# Altium schematic sheet Audio.SchDoc
size A4; DocumentNumber: 4; Revision: B.2(PCB.SCH); SheetNumber: 4; SheetTotal: 6
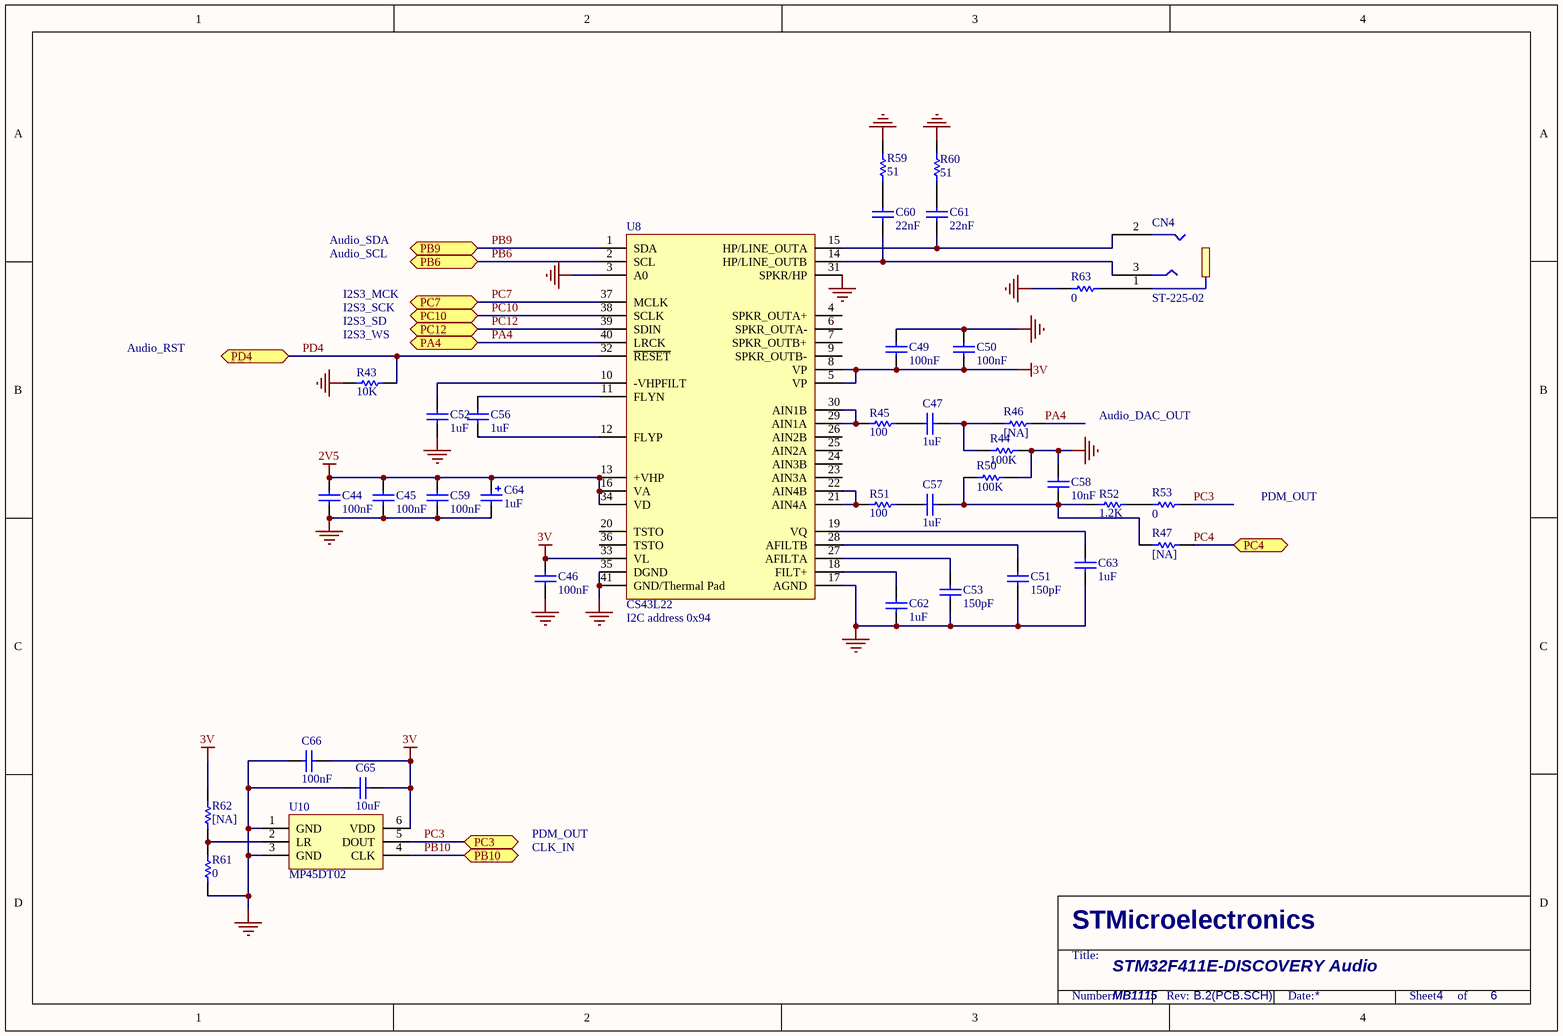
[diagram p0: Audio.SchDoc]

## Parts
C44  100nF  [0402C]
C45  100nF  [0402C]
C46  100nF  [0402C]
C47  1uF  [0603C]
C49  100nF  [0402C]
C50  100nF  [0402C]
C51  150pF  [0603C]
C52  1uF  [0603C]
C53  150pF  [0603C]
C56  1uF  [0603C]
C57  1uF  [0603C]
C58  10nF  [0603C]
C59  100nF  [0402C]
C60  22nF  [0603C]
C61  22nF  [0603C]
C62  1uF  [0603C]
C63  1uF  [0603C]
C64  1uF  [TAN-A]
C65  10uF  [0603C]
C66  100nF  [0402C]
CN4  ST-225-02  [Jack-ST-225]
R43  10K  [0402R]
R44  100K  [0402R]
R45  100  [0402R]
R46  [NA]  [0402R]
R47  [NA]  [0402R]
R50  100K  [0402R]
R51  100  [0402R]
R52  1.2K  [0402R]
R53  0  [0402R]
R59  51  [0402R]
R60  51  [0402R]
R61  0  [0402R]
R62  [NA]  [0402R]
R63  0  [0402R]
U8  CS43L22  [QFN40]
U10  MP45DT02  [HLGA-4.72-3.76-6LD]

## Ports
PA4, PB6, PB9, PB10, PC3, PC4, PC7, PC10, PC12, PD4

## Nets
2V5: C44.2 C45.2 C59.2 C64.1 U8.13(+VHP) U8.16(VA) U8.34(VD)
3V: C46.2 C49.1 C50.2 C65.2 C66.2 R62.2 U8.5(VP) U8.8(VP) U8.33(VL) U10.6(VDD)
GND: C44.1 C45.1 C46.1 C49.2 C50.1 C51.1 C52.2 C53.1 C58.2 C59.1 C62.1 C63.1 C64.2 C65.1 C66.1 R43.2 R44.2 R50.2 R59.2 R60.1 R61.1 R63.1 U8.3(A0) U8.17(AGND) U8.31(SPKR/HP) U8.35(DGND) U8.41(GND/Thermal_Pad) U10.1(GND) U10.3(GND)
PA4: R46.2 U8.40(LRCK) ; port PA4
PB6: U8.2(SCL) ; port PB6
PB9: U8.1(SDA) ; port PB9
PB10: U10.4(CLK) ; port PB10
PC3: R53.2 U10.5(DOUT) ; port PC3
PC4: R47.2 ; port PC4
PC7: U8.37(MCLK) ; port PC7
PC10: U8.38(SCLK) ; port PC10
PC12: U8.39(SDIN) ; port PC12
PD4: R43.1 U8.32(~{RESET}) ; port PD4
NetC47_1: C47.1 R45.1
NetC47_2: C47.2 R44.1 R46.1
NetC51_2: C51.2 U8.28(AFILTB)
NetC52_1: C52.1 U8.10(-VHPFILT)
NetC53_2: C53.2 U8.27(AFILTA)
NetC56_1: C56.1 U8.12(FLYP)
NetC56_2: C56.2 U8.11(FLYN)
NetC57_1: C57.1 R51.1
NetC57_2: C57.2 C58.1 R47.1 R50.1 R52.1
NetC60_1: C60.1 CN4.3 U8.14(HP/LINE_OUTB)
NetC60_2: C60.2 R59.1
NetC61_1: C61.1 CN4.2 U8.15(HP/LINE_OUTA)
NetC61_2: C61.2 R60.2
NetC62_2: C62.2 U8.18(FILT+)
NetC63_2: C63.2 U8.19(VQ)
NetCN4_1: CN4.1 R63.2
NetR45_2: R45.2 U8.29(AIN1A) U8.30(AIN1B)
NetR51_2: R51.2 U8.21(AIN4A) U8.22(AIN4B)
NetR52_2: R52.2 R53.1
NetR61_2: R61.2 R62.1 U10.2(LR)

Not connected (* = marked no-connect by the designer): U8 4(SPKR_OUTA+) 6(SPKR_OUTA-) 7(SPKR_OUTB+) 9(SPKR_OUTB-) 20(TSTO) 23(AIN3A) 24(AIN3B) 25(AIN2A) 26(AIN2B) 36(TSTO)

## Notes on the sheet
- Audio_SDA
- Audio_SCL
- I2S3_MCK
- I2S3_SCK
- Audio_RST
- (near R43) I2S3_WS
- I2S3_SD
- Audio_DAC_OUT
- PDM_OUT
- (near U8) I2C address 0x94
- CLK_IN
- STM32F411E-DISCOVERY Audio
- MB1115
- STMicroelectronics
- Title:
- Number:
- Rev:
- Date:
- Sheet       of

## Library data of the parts
C44-C46 C49 C50 C59 C66 = Cap_100nF_X7R_10%_0402: Capacitor,100nF,16V,X7R,10%,0402,YAGEO; Manuf_Part_1: CC0402KRX7R7BB104; Revision: July-2002: Re-released for DXP Platform.; Value: 100nF; Order: CC0402KRX7R7BB104; Manuf_1: YAGEO
C47 C52 C56 C57 C62 C63 = Cap_1uF_X5R_10%_0603: Capacitor,1uF,16V,X5R,10%,0603,YAGEO; Manuf_Part_1: CC0603KRX5R7BB105; Revision: July-2002: Re-released for DXP Platform.; Value: 1uF; Order: CC0603KRX5R7BB105; Manuf_1: YAGEO
C51 C53 = Cap_150pF_NPO_5%_0603: Capacitor,150pF,50V,NPO,5%,0603,YAGEO; Order: CC0603JRNPO9BN151; Revision: July-2002: Re-released for DXP Platform.; Value: 150pF; Manuf_1: YAGEO; Manuf_Part_1: CC0603JRNPO9BN151
C58 = Cap_10nF_X7R_10%_0603: Capacitor,10nF,50V,X7R,10%,0603,YAGEO; Manuf_Part_1: CC0603KRX7R9BB103; Revision: July-2002: Re-released for DXP Platform.; Value: 10nF; Order: CC0603KRX7R9BB103; Manuf_1: YAGEO
C60 C61 = Cap_22nF_X7R_10%_0603: Capacitor,22nF,50V,X7R,10%,0603,YAGEO; Manuf_Part_1: CC0603KRX7R9BB223; Revision: July-2002: Re-released for DXP Platform.; Value: 22nF; Order: CC0603KRX7R9BB223; Manuf_1: YAGEO
C64 = Cap_1uF_POL_10%_TANA: Polarized Capacitor,1uF,16V,10%,typeA,AVX; Manuf_Part_1: TAJA105K016R; Revision: July-2002: Re-released for DXP Platform.; Value: 1uF; Manuf_1: AVX; Distrib: *; Order: TAJA105K016R
C65 = Cap_10uF_X5R_10%_0603: Capacitor,10uF,6.3V,X5R,20%,0603,YAGEO; Manuf_Part_1: CC0603KRX5R5BB106; Revision: July-2002: Re-released for DXP Platform.; Value: 10uF; Order: CC0603KRX5R5BB106; Manuf_1: YAGEO
CN4 = ST-225-02: Connector Jack 35mm; Manuf_1: XIEJIA Electronics; Order: ST-225-02; Manuf_Part_1: ST-225-02
R43-R45 R50 R51 R59 R60 = res1: Resistor; Value: 1K; Published: 8-Jun-2000; Revision: July-2002: Re-released for DXP Platform.; Publisher: Altium Limited
R46 R47 R62 = Res_NA_0402: Resistor,[NA],0402; Fitted: NO; Value: [NA]
R52 = res1: Resistor; Published: 8-Jun-2000; Revision: July-2002: Re-released for DXP Platform.; Publisher: Altium Limited; Value: 1.2K
R53 R61 R63 = Res_0_0402: Resistor,0,0402; Value: 0
U8 = CS43L22: Low Power, Stereo DAC w/Headphone & Speaker Amps; Manuf_1: Cirrus; Order: CS43L22-CNZ; Manuf_Part_1: CS43L22-CNZ; Distrib: *; ECCN_US/EU: *
U10 = MP45DT02: MEMS audio sensor, omnidirectional digital microphone; Manuf_1: STM; Manuf_Part_1: MP45DT02TR; Provided: ST; Ref St: 9188006; ECCN_US/EU: EAR99/NEC; Order: MP45DT02TR; Distrib: ST